# EAGLE schematic kaimat (EAGLE 9.3.0)
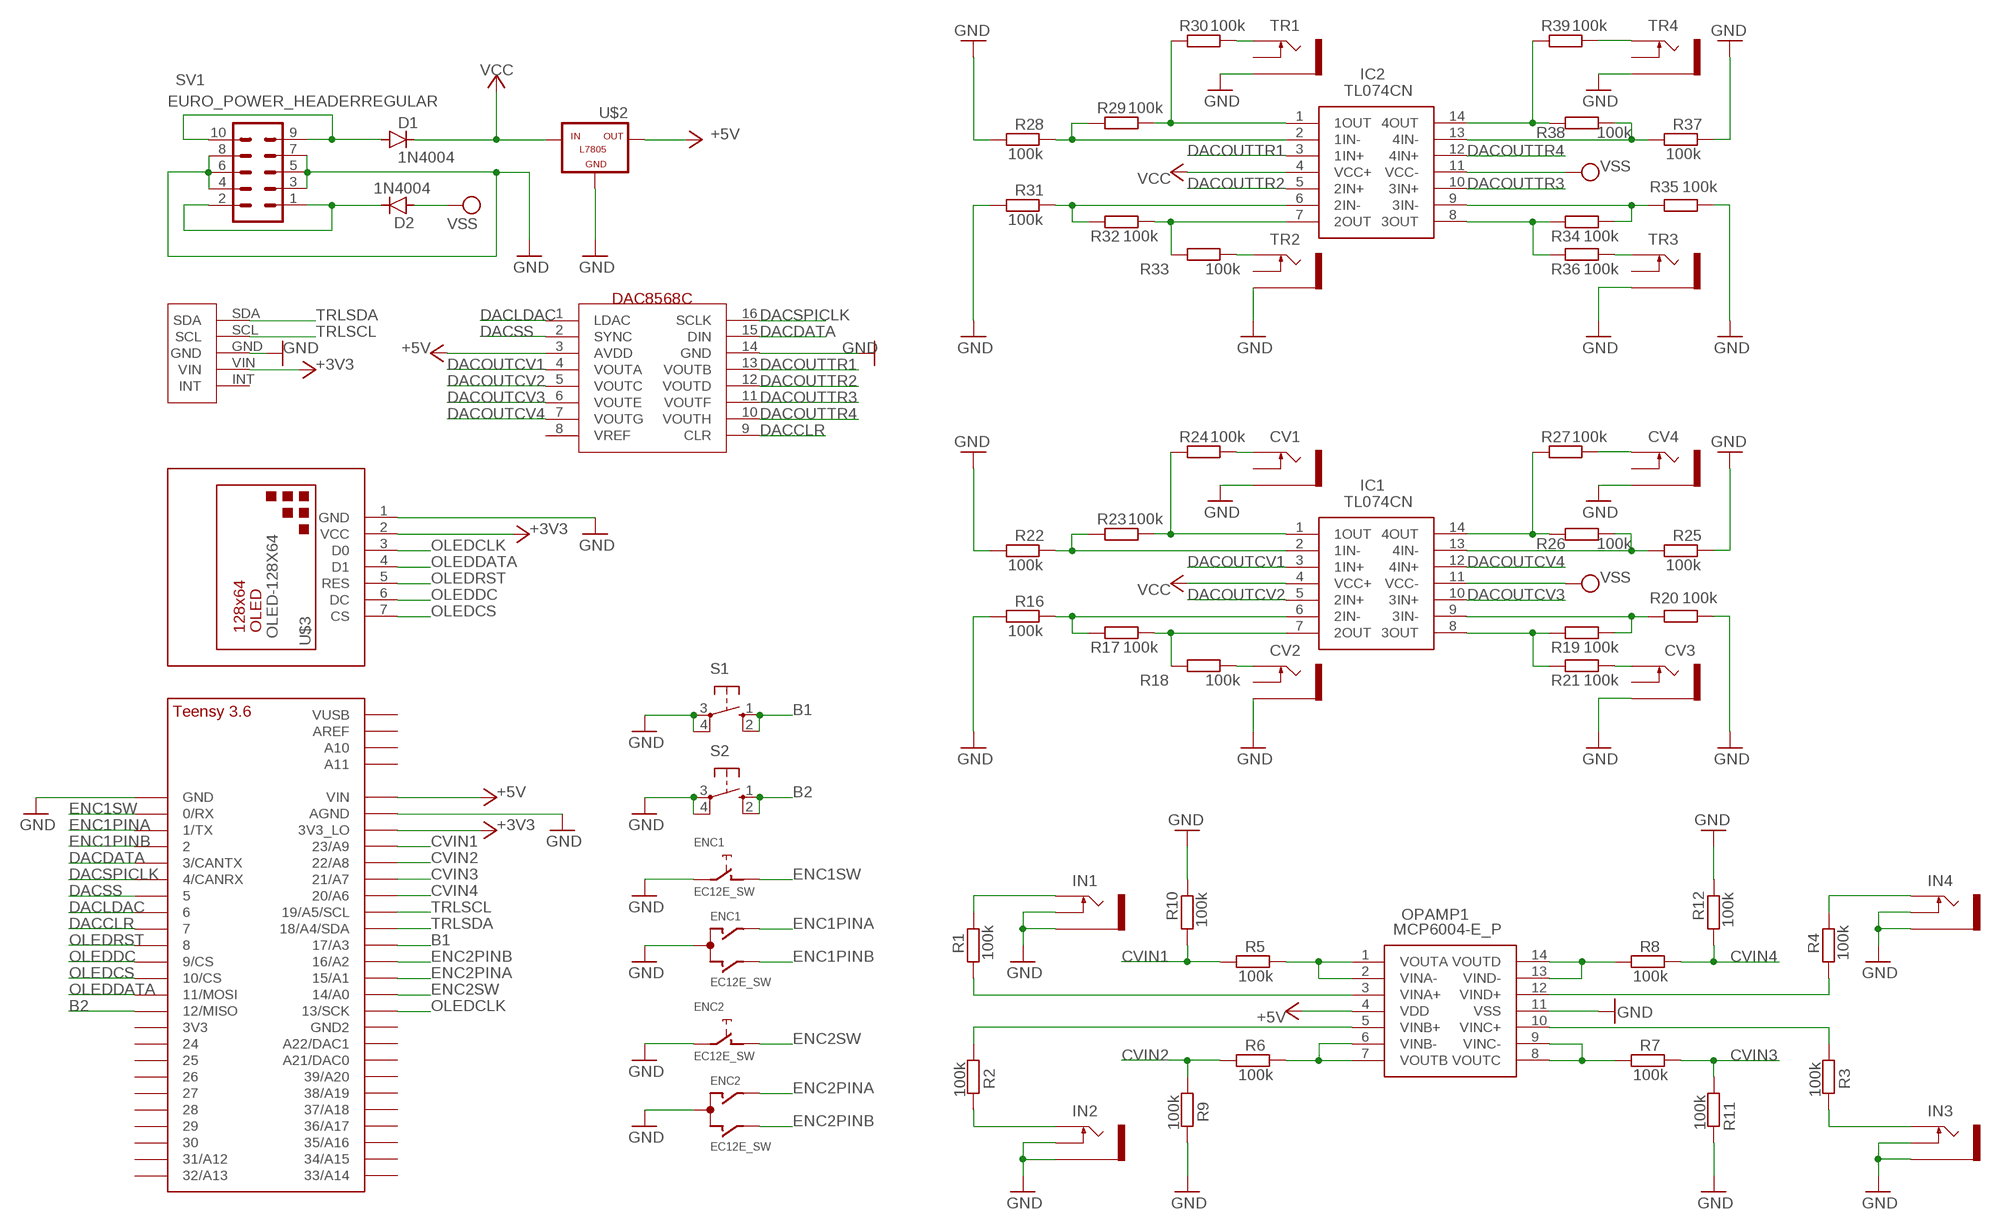
[diagram p0: schematic, sheet 1]

## Parts
CV1  THONKICONNNEW  [WQP-PJ301M-12_JACK]
CV2  THONKICONNNEW  [WQP-PJ301M-12_JACK]
CV3  THONKICONNNEW  [WQP-PJ301M-12_JACK]
CV4  THONKICONNNEW  [WQP-PJ301M-12_JACK]
D1  1N4004  [DO41-10]
D2  1N4004  [DO41-10]
ENC1  EC12E_SW  [ALPS_EC12E_SW]
ENC2  EC12E_SW  [ALPS_EC12E_SW]
IC1  TL074CN  [DIP794W53P254L1930H508Q14N]
IC2  TL074CN  [DIP794W53P254L1930H508Q14N]
IN1  THONKICONNNEW  [WQP-PJ301M-12_JACK]
IN2  THONKICONNNEW  [WQP-PJ301M-12_JACK]
IN3  THONKICONNNEW  [WQP-PJ301M-12_JACK]
IN4  THONKICONNNEW  [WQP-PJ301M-12_JACK]
OPAMP1  MCP6004-E_P  [DIP781W56P254L1918H533Q14N]
R1  100k  RESISTOR7MM  [7MM_RESISTOR]
R2  100k  RESISTOR7MM  [7MM_RESISTOR]
R3  100k  RESISTOR7MM  [7MM_RESISTOR]
R4  100k  RESISTOR7MM  [7MM_RESISTOR]
R5  100k  RESISTOR7MM  [7MM_RESISTOR]
R6  100k  RESISTOR7MM  [7MM_RESISTOR]
R7  100k  RESISTOR7MM  [7MM_RESISTOR]
R8  100k  RESISTOR7MM  [7MM_RESISTOR]
R9  100k  RESISTOR7MM  [7MM_RESISTOR]
R10  100k  RESISTOR7MM  [7MM_RESISTOR]
R11  100k  RESISTOR7MM  [7MM_RESISTOR]
R12  100k  RESISTOR7MM  [7MM_RESISTOR]
R16  100k  RESISTOR7MM  [7MM_RESISTOR]
R17  100k  RESISTOR7MM  [7MM_RESISTOR]
R18  100k  RESISTOR7MM  [7MM_RESISTOR]
R19  100k  RESISTOR7MM  [7MM_RESISTOR]
R20  100k  RESISTOR7MM  [7MM_RESISTOR]
R21  100k  RESISTOR7MM  [7MM_RESISTOR]
R22  100k  RESISTOR7MM  [7MM_RESISTOR]
R23  100k  RESISTOR7MM  [7MM_RESISTOR]
R24  100k  RESISTOR7MM  [7MM_RESISTOR]
R25  100k  RESISTOR7MM  [7MM_RESISTOR]
R26  100k  RESISTOR7MM  [7MM_RESISTOR]
R27  100k  RESISTOR7MM  [7MM_RESISTOR]
R28  100k  RESISTOR7MM  [7MM_RESISTOR]
R29  100k  RESISTOR7MM  [7MM_RESISTOR]
R30  100k  RESISTOR7MM  [7MM_RESISTOR]
R31  100k  RESISTOR7MM  [7MM_RESISTOR]
R32  100k  RESISTOR7MM  [7MM_RESISTOR]
R33  100k  RESISTOR7MM  [7MM_RESISTOR]
R34  100k  RESISTOR7MM  [7MM_RESISTOR]
R35  100k  RESISTOR7MM  [7MM_RESISTOR]
R36  100k  RESISTOR7MM  [7MM_RESISTOR]
R37  100k  RESISTOR7MM  [7MM_RESISTOR]
R38  100k  RESISTOR7MM  [7MM_RESISTOR]
R39  100k  RESISTOR7MM  [7MM_RESISTOR]
S1  10-XX  [B3F-10XX]
S2  10-XX  [B3F-10XX]
SV1  EURO_POWER_HEADERREGULAR  [EURO_POWER_HEADER]
TR1  THONKICONNNEW  [WQP-PJ301M-12_JACK]
TR2  THONKICONNNEW  [WQP-PJ301M-12_JACK]
TR3  THONKICONNNEW  [WQP-PJ301M-12_JACK]
TR4  THONKICONNNEW  [WQP-PJ301M-12_JACK]
U$1  TEENSY_3.5/3.6_BASIC  [TEENSY_3.5/3.6_BASIC]
U$2  -L7805  [L7805]
U$3  OLED-128X64  [DISPLAY-OLED-128X64-SMALL]
U$4  NEOTRELLISKAIMAT2  [NEOTRELLISKAIMAT2]
U$5  DAC8568C  [TSSOP16]

## Nets
+3V3: U$1.3V3_LO U$3.2(VCC) U$4.VIN
+5V: OPAMP1.4(VDD) U$1.VIN U$2.OUT U$5.3(AVDD)
B1: S1.1(S) S1.2(S1) U$1.17/A3
B2: S2.1(S) S2.2(S1) U$1.12/MISO
CVIN1: R5.1 R10.1 U$1.23/A9
CVIN2: R6.1 R9.1 U$1.22/A8
CVIN3: R7.2 R11.1 U$1.21/A7
CVIN4: R8.2 R12.1 U$1.20/A6
DACCLR: U$1.7 U$5.9(CLR)
DACDATA: U$1.3/CANTX U$5.15(DIN)
DACLDAC: U$1.6 U$5.1(LDAC)
DACOUTCV1: IC1.3(1IN+) U$5.4(VOUTA)
DACOUTCV2: IC1.5(2IN+) U$5.5(VOUTC)
DACOUTCV3: IC1.10(3IN+) U$5.6(VOUTE)
DACOUTCV4: IC1.12(4IN+) U$5.7(VOUTG)
DACOUTTR1: IC2.3(1IN+) U$5.13(VOUTB)
DACOUTTR2: IC2.5(2IN+) U$5.12(VOUTD)
DACOUTTR3: IC2.10(3IN+) U$5.11(VOUTF)
DACOUTTR4: IC2.12(4IN+) U$5.10(VOUTH)
DACSPICLK: U$1.4/CANRX U$5.16(SCLK)
DACSS: U$1.5 U$5.2(SYNC)
ENC1PINA: ENC1.A U$1.1/TX
ENC1PINB: ENC1.B U$1.2
ENC1SW: ENC1.D U$1.0/RX
ENC2PINA: ENC2.A U$1.15/A1
ENC2PINB: ENC2.B U$1.16/A2
ENC2SW: ENC2.D U$1.14/A0
GND: CV1.P$3_SLEEVE(SLEEVE) CV2.P$3_SLEEVE(SLEEVE) CV3.P$3_SLEEVE(SLEEVE) CV4.P$3_SLEEVE(SLEEVE) ENC1.C ENC1.E ENC2.C ENC2.E IN1.P$2_SWITCH(SWITCH) IN1.P$3_SLEEVE(SLEEVE) IN2.P$2_SWITCH(SWITCH) IN2.P$3_SLEEVE(SLEEVE) IN3.P$2_SWITCH(SWITCH) IN3.P$3_SLEEVE(SLEEVE) IN4.P$2_SWITCH(SWITCH) IN4.P$3_SLEEVE(SLEEVE) OPAMP1.11(VSS) R9.2 R10.2 R11.2 R12.2 R16.1 R20.2 R22.1 R25.2 R28.1 R31.1 R35.2 R37.2 S1.3(P) S1.4(P1) S2.3(P) S2.4(P1) SV1.3 SV1.4 SV1.5 SV1.6 SV1.7 SV1.8 TR1.P$3_SLEEVE(SLEEVE) TR2.P$3_SLEEVE(SLEEVE) TR3.P$3_SLEEVE(SLEEVE) TR4.P$3_SLEEVE(SLEEVE) U$1.AGND U$1.GND U$2.GND U$3.1(GND) U$4.GND U$5.14(GND)
N$1: D1.A SV1.9 SV1.10
N$2: IC1.7(2OUT) R17.2 R18.1
N$3: IN1.P$1_TIP(TIP) R1.2
N$4: OPAMP1.6(VINB-) OPAMP1.7(VOUTB) R6.2
N$5: IN2.P$1_TIP(TIP) R2.2
N$6: IN3.P$1_TIP(TIP) R3.2
N$7: IC2.7(2OUT) R32.2 R33.1
N$9: IN4.P$1_TIP(TIP) R4.2
N$11: OPAMP1.5(VINB+) R2.1
N$12: OPAMP1.13(VIND-) OPAMP1.14(VOUTD) R8.1
N$13: OPAMP1.8(VOUTC) OPAMP1.9(VINC-) R7.1
N$14: OPAMP1.3(VINA+) R1.1
N$15: OPAMP1.10(VINC+) R3.1
N$16: OPAMP1.12(VIND+) R4.1
N$17: IC1.6(2IN-) R16.2 R17.1
N$18: OPAMP1.1(VOUTA) OPAMP1.2(VINA-) R5.2
N$19: CV2.P$1_TIP(TIP) R18.2
N$20: CV3.P$1_TIP(TIP) R21.2
N$21: IC1.8(3OUT) R19.1 R21.1
N$22: IC1.9(3IN-) R19.2 R20.1
N$23: IC1.2(1IN-) R22.2 R23.1
N$24: IC1.1(1OUT) R23.2 R24.1
N$25: CV1.P$1_TIP(TIP) R24.2
N$26: IC1.13(4IN-) R25.1 R26.2
N$27: IC1.14(4OUT) R26.1 R27.1
N$28: CV4.P$1_TIP(TIP) R27.2
N$29: D2.C SV1.1 SV1.2
N$30: IC2.2(1IN-) R28.2 R29.1
N$31: IC2.1(1OUT) R29.2 R30.1
N$32: IC2.6(2IN-) R31.2 R32.1
N$33: R30.2 TR1.P$1_TIP(TIP)
N$34: R33.2 TR2.P$1_TIP(TIP)
N$35: IC2.9(3IN-) R34.2 R35.1
N$36: R36.2 TR3.P$1_TIP(TIP)
N$37: IC2.8(3OUT) R34.1 R36.1
N$38: IC2.13(4IN-) R37.1 R38.2
N$39: IC2.14(4OUT) R38.1 R39.1
N$40: R39.2 TR4.P$1_TIP(TIP)
OLEDCLK: U$1.13/SCK U$3.3(D0)
OLEDCS: U$1.10/CS U$3.7(CS)
OLEDDATA: U$1.11/MOSI U$3.4(D1)
OLEDDC: U$1.9/CS U$3.6(DC)
OLEDRST: U$1.8 U$3.5(RES)
TRLSCL: U$1.19/A5/SCL U$4.SCL
TRLSDA: U$1.18/A4/SDA U$4.SDA
VCC: D1.C IC1.4(VCC+) IC2.4(VCC+) U$2.IN
VSS: D2.A IC1.11(VCC-) IC2.11(VCC-)
Unconnected: CV1.P$2_SWITCH(SWITCH) CV2.P$2_SWITCH(SWITCH) CV3.P$2_SWITCH(SWITCH) CV4.P$2_SWITCH(SWITCH) ENC1.GND1(G) ENC1.GND2(G) ENC2.GND1(G) ENC2.GND2(G) TR1.P$2_SWITCH(SWITCH) TR2.P$2_SWITCH(SWITCH) TR3.P$2_SWITCH(SWITCH) TR4.P$2_SWITCH(SWITCH) U$1.3V3 U$1.21/DAC0(A21/DAC0) U$1.24 U$1.25 U$1.26 U$1.27 U$1.28 U$1.29 U$1.30 U$1.31/A12 U$1.32/A13 U$1.33/A14 U$1.34/A15 U$1.35/A16 U$1.36/A17 U$1.37/A18 U$1.38/A19 U$1.39/A20 U$1.A10 U$1.A11 U$1.A22/DAC1 U$1.AREF U$1.GND2 U$1.VUSB U$4.INT U$5.8(VREF)

## Library data of the parts
CV1-CV4 IN1-IN4 TR1-TR4 = MusicThingModular:THONKICONN: 3.5mm socket for Eurorack modular synths
D1 D2 = diode:1N4004: DIODE general purpose rectifier, 1 A
ENC1 ENC2 = switch-alps:EC12E_SW: ALPS rotary Encoder EC12E series with switch; MPN: EC12E2424407; OC_FARNELL: 1520813; OC_NEWARK: 74M1068
IC1 IC2 = TL074CN:TL074CN: Quad Low-Noise JFET-Input General-Purpose Operational Amplifier Source: Datasheet <http://uk.rs-online.com/web/p/products/0302621>; DESCRIPTION: Quad Low-Noise JFET-Input General-Purpose Operational Amplifier; HEIGHT: 5.08mm; MANUFACTURER_NAME: Texas Instruments; MANUFACTURER_PART_NUMBER: TL074CN; MOUSER_PART_NUMBER: 595-TL074CN; MOUSER_PRICE-STOCK: https://www.mouser.com/Search/Refine.aspx?Keyword=595-TL074CN; RS_PART_NUMBER: 0302621P; RS_PRICE-STOCK: http://uk.rs-online.com/web/p/products/0302621P
OPAMP1 = mcp6004-e_p:MCP6004-E_P: Microchip MCP6004-E/P Op Amp, 1MHz, 1.8 6 V Rail-Rail 0.6V/s Linear, 14-pin PDIP Source: Datasheet <http://docs-asia.electrocomponents.com/webdocs/1381/0900766b81381145.pdf>; DESCRIPTION: Microchip MCP6004-E/P Op Amp, 1MHz, 1.8 6 V Rail-Rail 0.6V/s Linear, 14-pin PDIP; HEIGHT: 5.334mm; MANUFACTURER_NAME: Microchip; MANUFACTURER_PART_NUMBER: mcp6004-e/p; MOUSER_PART_NUMBER: 579-MCP6004-E/P; MOUSER_PRICE-STOCK: https://www.mouser.com/Search/Refine.aspx?Keyword=579-MCP6004-E%2FP; RS_PART_NUMBER: 7386178P; RS_PRICE-STOCK: http://uk.rs-online.com/web/p/products/7386178P
R1-R12 R16-R39 = MusicThingModular:RESISTOR: Standard resistor, various versions
S1 S2 = switch-omron:10-XX: OMRON SWITCH; MPN: B3F-1000; OC_FARNELL: 176432; OC_NEWARK: 36M3542
SV1 = MusicThingModular:EURO_POWER_HEADER: Power Header 10 pin power header for Eurorack Power Supplies Variants with fatter pads for easier soldering, and the LOCK variant which has 5mil offset pins to hold the component in place before soldering
U$1 = Teensy356:TEENSY_3.5/3.6_BASIC; OC_FARNELL: unknown
U$2 = tango:-L7805
U$3 = diy-modules:OLED-128X64
U$4 = Adafruit Trellis:NEOTRELLISKAIMAT2
U$5 = analog-devices-3:DAC8568C

## Net classes
1 power: width 0.406 mm